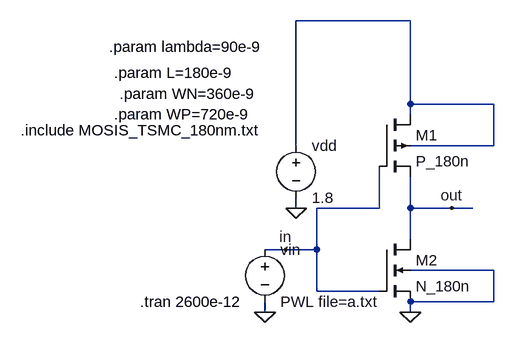
[diagram p0: schematic inverter.asc]
inverter.asc, the LTspice schematic file:
Version 4
SHEET 1 880 680
WIRE 176 -112 0 -112
WIRE 176 16 176 -112
WIRE 304 16 176 16
WIRE 176 32 176 16
WIRE 0 80 0 -112
WIRE 304 80 304 16
WIRE 304 80 176 80
WIRE 0 176 0 160
WIRE 128 176 128 112
WIRE 128 176 32 176
WIRE 176 176 176 128
WIRE 240 176 176 176
WIRE 272 176 240 176
WIRE 176 224 176 176
WIRE -16 240 -48 240
WIRE 32 240 32 176
WIRE 32 240 -16 240
WIRE 304 272 176 272
WIRE 32 304 32 240
WIRE 128 304 32 304
WIRE 304 320 304 272
WIRE 304 320 176 320
WIRE -48 336 -48 320
WIRE 176 336 176 320
FLAG 176 336 0
FLAG 0 176 0
FLAG -16 240 in
FLAG 240 176 out
FLAG -48 336 0
SYMBOL pmos4 128 32 R0
SYMATTR InstName M1
SYMATTR Value P_180n
SYMATTR Value2 l={L} w={WP} ad={WP*5*lambda} as={WP*5*lambda} pd={2*WP+10*lambda} ps={2*WP+10*lambda}
SYMBOL nmos4 128 224 R0
SYMATTR InstName M2
SYMATTR Value N_180n
SYMATTR Value2 l={L} w={WN} ad={WN*5*lambda} as={WN*5*lambda} pd={2*WN+10*lambda} ps={2*WN+10*lambda}
SYMBOL voltage 0 64 R0
SYMATTR InstName vdd
SYMATTR Value 1.8
SYMBOL voltage -48 224 R0
WINDOW 123 0 0 Left 0
WINDOW 39 0 0 Left 0
SYMATTR InstName vin
SYMATTR Value PWL file=a.txt
TEXT -288 -72 Left 2 !.param lambda=90e-9
TEXT -280 -32 Left 2 !.param L=180e-9
TEXT -272 0 Left 2 !.param WN=360e-9
TEXT -280 32 Left 2 !.param WP=720e-9
TEXT -424 56 Left 2 !.include MOSIS_TSMC_180nm.txt
TEXT -240 320 Left 2 !.tran 2600e-12

The netlist it stands for:
* inverter.asc
M1 N001 in out N001 P_180n l={L} w={WP} ad={WP*5*lambda} as={WP*5*lambda} pd={2*WP+10*lambda} ps={2*WP+10*lambda}
M2 out in 0 0 N_180n l={L} w={WN} ad={WN*5*lambda} as={WN*5*lambda} pd={2*WN+10*lambda} ps={2*WN+10*lambda}
vdd N001 0 1.8
vin in 0 PWL file=a.txt
.model NMOS NMOS
.model PMOS PMOS
.lib standard.mos
.param lambda=90e-9
.param L=180e-9
.param WN=360e-9
.param WP=720e-9
.include MOSIS_TSMC_180nm.txt
.tran 2600e-12
.backanno
.end